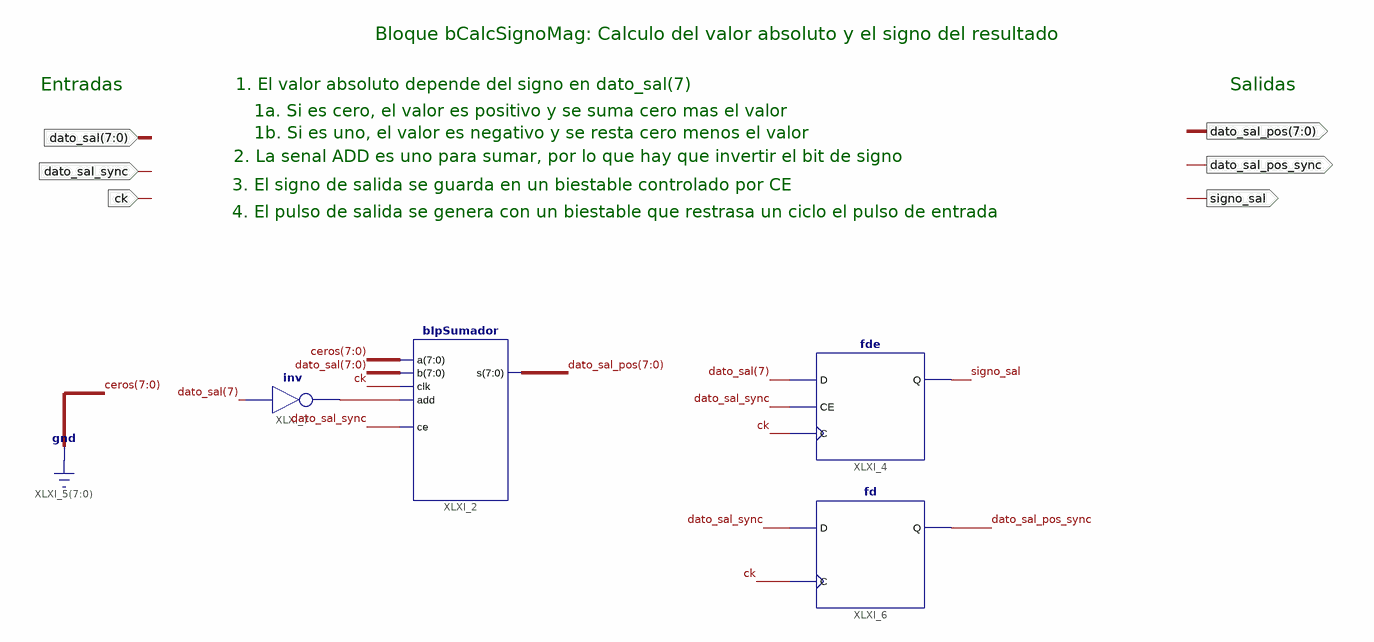
[diagram p0: schematic sheet 1]
// Xilinx ISE schematic bCalcSignoMag.sch (spartan6) as structural Verilog: 4 symbols, 6 ports
module bCalcSignoMag (
  input  [7:0] dato_sal,
  input  ck,
  input  dato_sal_sync,
  output signo_sal,
  output dato_sal_pos_sync,
  output [7:0] dato_sal_pos
);

  wire XLXN_5;

  fd XLXI_6 (.C(ck), .D(dato_sal_sync), .Q(dato_sal_pos_sync));
  fde XLXI_4 (.C(ck), .CE(dato_sal_sync), .D(dato_sal[7]), .Q(signo_sal));
  bIpSumador XLXI_2 (.a({8{1'b0}}), .b(dato_sal), .clk(ck), .add(XLXN_5), .ce(dato_sal_sync), .s(dato_sal_pos));
  not XLXI_7 (XLXN_5, dato_sal[7]);

  // Notes on the sheet:
  //   Bloque bCalcSignoMag: Calculo del valor absoluto y el signo del resultado
  //   Entradas
  //   1. El valor absoluto depende del signo en dato_sal(7)
  //   Salidas
  //   1a. Si es cero, el valor es positivo y se suma cero mas el valor
  //   1b. Si es uno, el valor es negativo y se resta cero menos el valor
  //   2. La senal ADD es uno para sumar, por lo que hay que invertir el bit de signo
  //   3. El signo de salida se guarda en un biestable controlado por CE
  //   4. El pulso de salida se genera con un biestable que restrasa un ciclo el pulso de entrada
endmodule
